# Altium schematic sheet LTC_Sheet.SchDoc
size A3
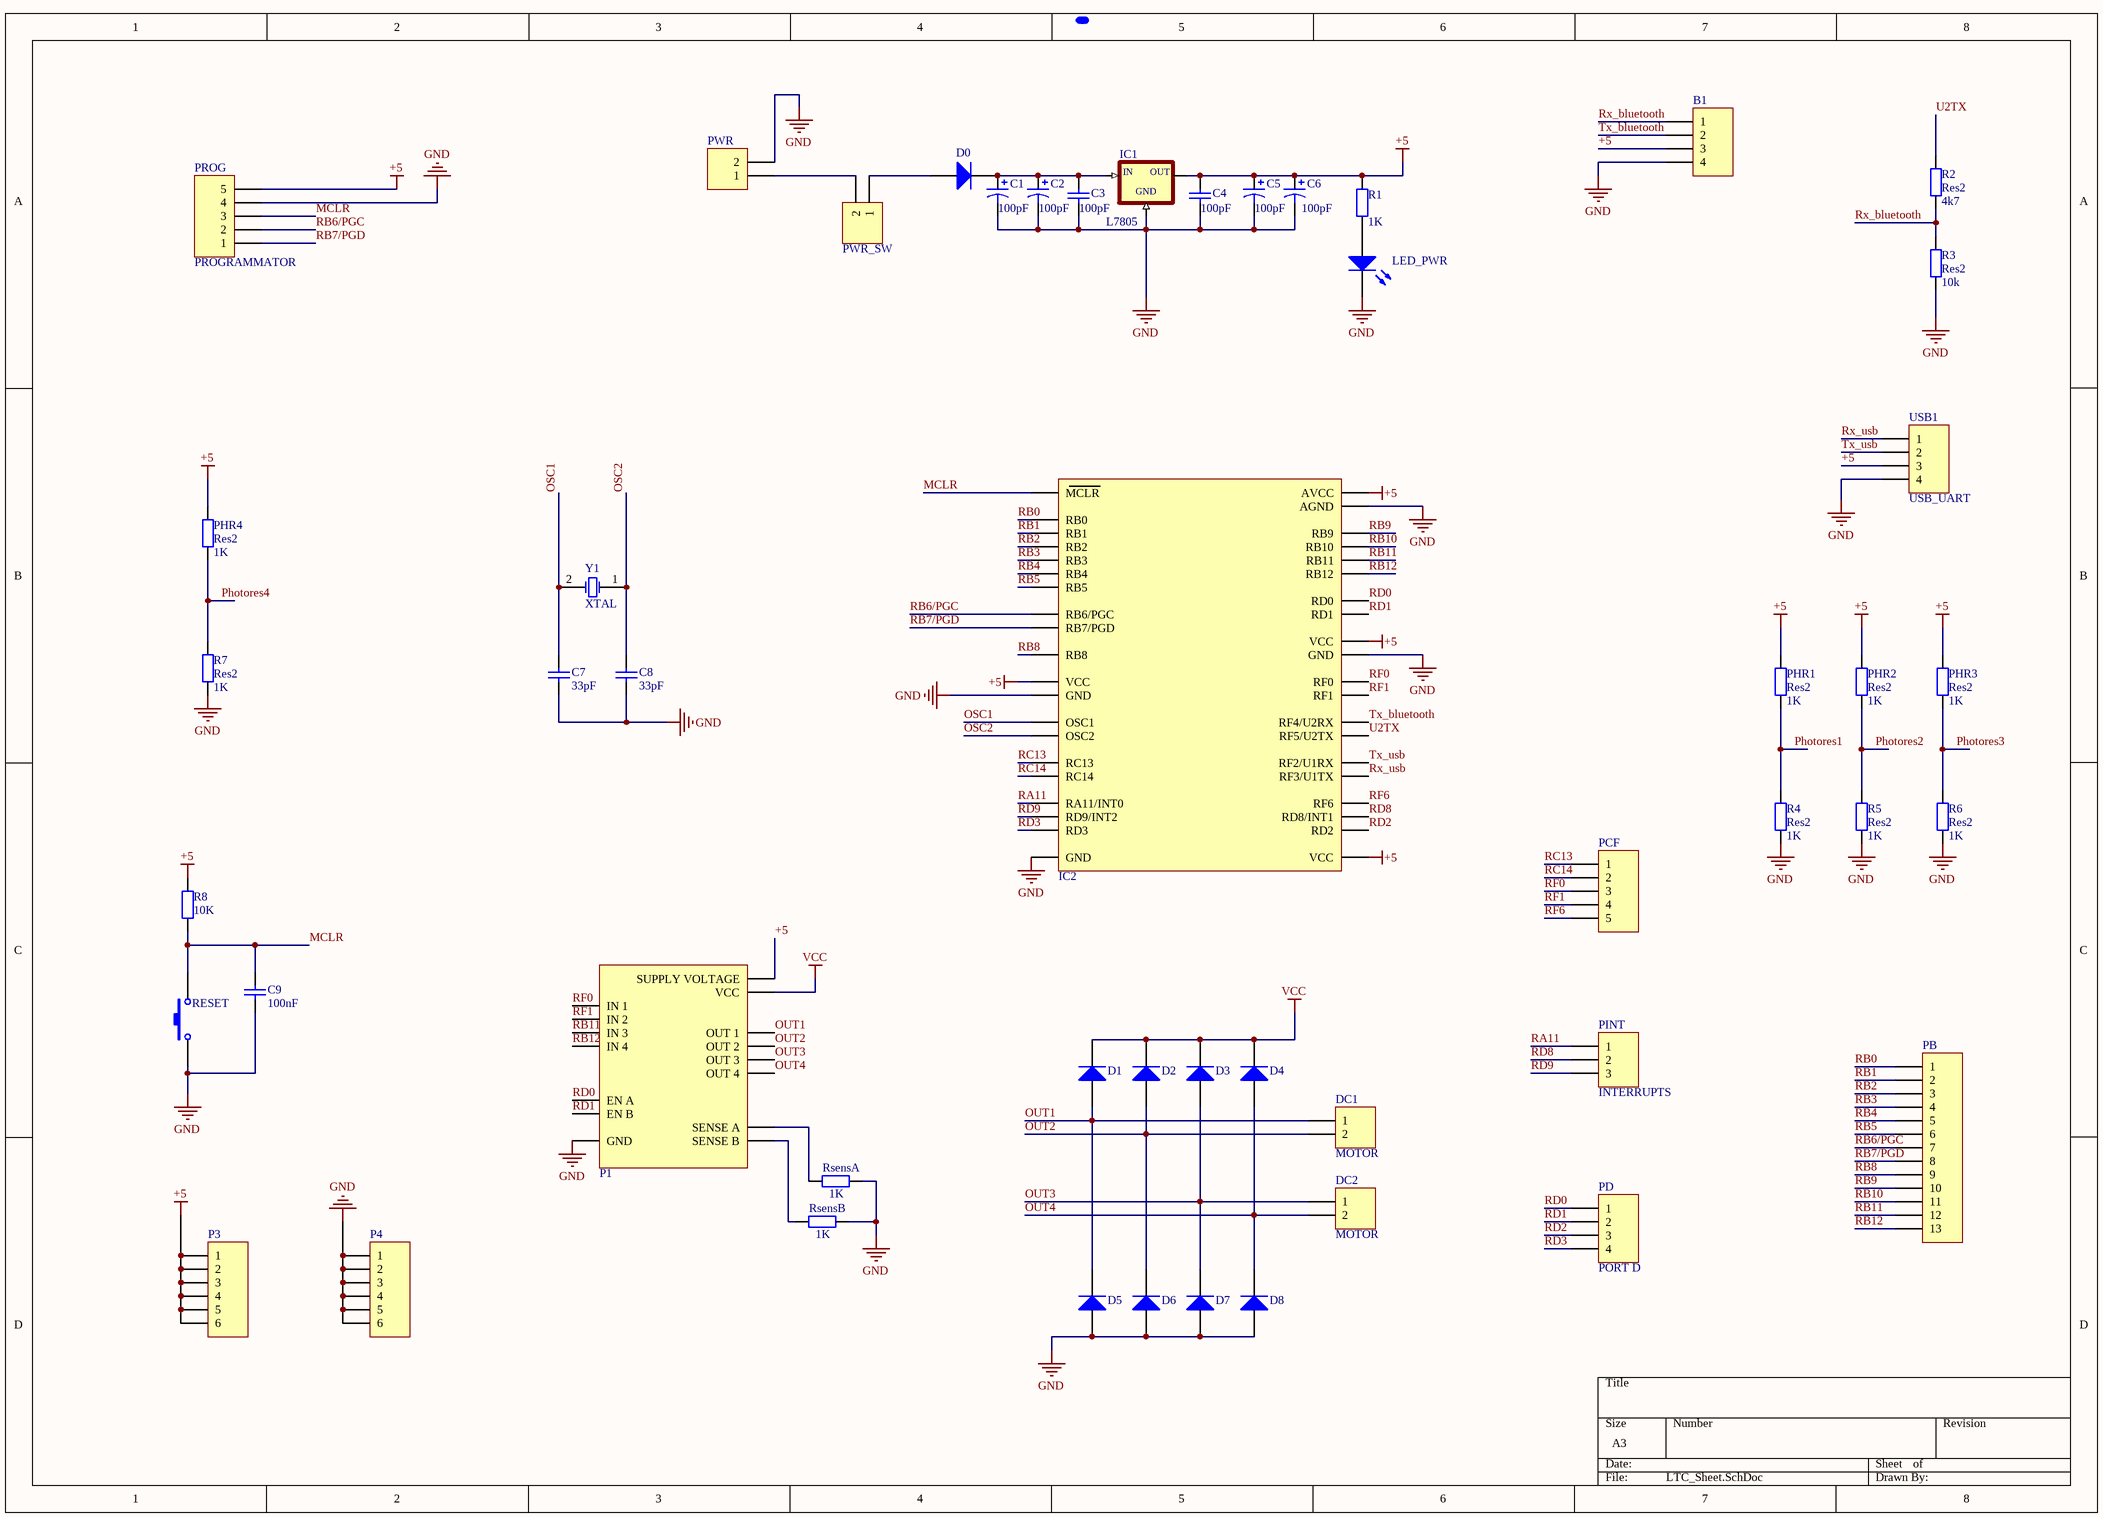
[diagram p0: LTC_Sheet.SchDoc]

## Parts
B1  (no value)  [HDR1X4]
C1  value 100pF  [RB7.6-15]
C2  value 100pF  [RB7.6-15]
C3  value 100pF  [RAD-0.3]
C4  value 100pF  [RAD-0.3]
C5  value 100pF  [RB7.6-15]
C6  value 100pF  [RB7.6-15]
C7  value 33pF  [RAD-0.3]  (hidden comment: Cap)
C8  value 33pF  [RAD-0.3]  (hidden comment: Cap)
C9  value 100nF  [RAD-0.3]  (hidden comment: Cap)
D0  (no value)  [DO-41]
D1  Diode 1N914  [DO-35]  (value not drawn)
D2  Diode 1N914  [DO-35]  (value not drawn)
D3  Diode 1N914  [DO-35]  (value not drawn)
D4  Diode 1N914  [DO-35]  (value not drawn)
D5  Diode 1N914  [DO-35]  (value not drawn)
D6  Diode 1N914  [DO-35]  (value not drawn)
D7  Diode 1N914  [DO-35]  (value not drawn)
D8  Diode 1N914  [DO-35]  (value not drawn)
DC1  MOTOR  [HDR1X2]
DC2  MOTOR  [HDR1X2]
IC1  L7805  [78XXS]
IC2  dsPIC30F4013  (value not drawn)
LED_PWR  (no value)  [LED-1]
P1  L298N  (value not drawn)
P3  (no value)  [HDR1X6]
P4  (no value)  [HDR1X6]
PB  (no value)  [HDR1X13]
PCF  (no value)  [HDR1X5]
PD  PORT D  [HDR1X4]
PHR1  Res2  value 1K  [AXIAL-0.4]
PHR2  Res2  value 1K  [AXIAL-0.4]
PHR3  Res2  value 1K  [AXIAL-0.4]
PHR4  Res2  value 1K  [AXIAL-0.4]
PINT  INTERRUPTS  [HDR1X3]
PROG  PROGRAMMATOR  [HDR1X5]
PWR  Header 2  [HDR1X2]  (value not drawn)
PWR_SW  Header 2  [HDR1X2]  (value not drawn)
R1  value 1K  [AXIAL-0.4]
R2  Res2  value 4k7  [AXIAL-0.4]
R3  Res2  value 10k  [AXIAL-0.4]
R4  Res2  value 1K  [AXIAL-0.4]
R5  Res2  value 1K  [AXIAL-0.4]
R6  Res2  value 1K  [AXIAL-0.4]
R7  Res2  value 1K  [AXIAL-0.4]
R8  value 10K  [AXIAL-0.4]  (hidden comment: Res2)
RESET  SW-PB  [SPST-2]  (value not drawn)
RsensA  value 1K  [AXIAL-0.4]
RsensB  value 1K  [AXIAL-0.4]
USB1  USB_UART  [HDR1X4]
Y1  XTAL  [R38]

## Nets
+5: B1.3 C4.2 C5.1 C6.1 IC1.OUT IC2.11(VCC) IC2.21(VCC) IC2.32(VCC) IC2.40(AVCC) P1.4(SUPPLY_VOLTAGE) P3.1 P3.2 P3.3 P3.4 P3.5 P3.6 PHR1.2 PHR2.2 PHR3.2 PHR4.2 PROG.5 R1.2 R8.2 USB1.3
GND: B1.4 C1.2 C2.2 C3.1 C4.1 C5.2 C6.2 C7.1 C8.1 C9.2 D5.1(A) D6.1(A) D7.1(A) D8.1(A) IC1.GND IC2.12(GND) IC2.20(GND) IC2.31(GND) IC2.39(AGND) LED_PWR.2(K) P1.8(GND) P4.1 P4.2 P4.3 P4.4 P4.5 P4.6 PROG.4 PWR.2 R3.1 R4.1 R5.1 R6.1 R7.1 RESET.1 RsensA.2 RsensB.2 USB1.4
VCC: D1.2(K) D2.2(K) D3.2(K) D4.2(K) P1.9(VCC)
MCLR: C9.1 IC2.1(MCLR) PROG.3 R8.1 RESET.2
OSC1: C7.2 IC2.13(OSC1) Y1.2(OSC2)
OSC2: C8.2 IC2.14(OSC2) Y1.1(OSC1)
OUT1: D1.1(A) D5.2(K) DC1.1 P1.2(OUT_1)
OUT2: D2.1(A) D6.2(K) DC1.2 P1.3(OUT_2)
OUT3: D3.1(A) D7.2(K) DC2.1 P1.13(OUT_3)
OUT4: D4.1(A) D8.2(K) DC2.2 P1.14(OUT_4)
Photores1: PHR1.1 R4.2
Photores2: PHR2.1 R5.2
Photores3: PHR3.1 R6.2
Photores4: PHR4.1 R7.2
RA11: IC2.17(RA11/INT0) PINT.1
RB0: IC2.2(RB0) PB.1
RB1: IC2.3(RB1) PB.2
RB2: IC2.4(RB2) PB.3
RB3: IC2.5(RB3) PB.4
RB4: IC2.6(RB4) PB.5
RB5: IC2.7(RB5) PB.6
RB6/PGC: IC2.8(RB6/PGC) PB.7 PROG.2
RB7/PGD: IC2.9(RB7/PGD) PB.8 PROG.1
RB8: IC2.10(RB8) PB.9
RB9: IC2.38(RB9) PB.10
RB10: IC2.37(RB10) PB.11
RB11: IC2.36(RB11) P1.10(IN_3) PB.12
RB12: IC2.35(RB12) P1.12(IN_4) PB.13
RC13: IC2.15(RC13) PCF.1
RC14: IC2.16(RC14) PCF.2
RD0: IC2.34(RD0) P1.6(EN_A) PD.1
RD1: IC2.33(RD1) P1.11(EN_B) PD.2
RD2: IC2.22(RD2) PD.3
RD3: IC2.19(RD3) PD.4
RD8: IC2.23(RD8/INT1) PINT.2
RD9: IC2.18(RD9/INT2) PINT.3
RF0: IC2.30(RF0) P1.5(IN_1) PCF.3
RF1: IC2.29(RF1) P1.7(IN_2) PCF.4
RF6: IC2.24(RF6) PCF.5
Rx_bluetooth: B1.1 R2.1 R3.2
Rx_usb: IC2.25(RF3/U1TX) USB1.1
Tx_bluetooth: B1.2 IC2.28(RF4/U2RX)
Tx_usb: IC2.26(RF2/U1RX) USB1.2
U2TX: IC2.27(RF5/U2TX) R2.2
NetC1_1: C1.1 C2.1 C3.2 D0.2(K) IC1.IN
NetD0_1: D0.1(A) PWR_SW.1
NetLED_PWR_1: LED_PWR.1(A) R1.1
NetP1_1: P1.1(SENSE_A) RsensA.1
NetP1_15: P1.15(SENSE_B) RsensB.1
NetPWR_1: PWR.1 PWR_SW.2

## Library data of the parts
B1 PD USB1 = Header 4: Header, 4-Pin; LatestRevisionDate: 17-Jul-2002; LatestRevisionNote: Re-released for DXP Platform.; Publisher: Altium Limited
C1 C2 C5 C6 = Cap Pol1: Polarized Capacitor (Radial); Published: 8-Jun-2000; LatestRevisionDate: 17-Jul-2002; LatestRevisionNote: Re-released for DXP Platform.; PackageReference: RB7.6-15; Publisher: Altium Limited; PackageDescription: Polarized Capacitor (Radial); 2 Leads
C3 C4 C7-C9 = Cap: Capacitor; Published: 8-Jun-2000; LatestRevisionDate: 17-Jul-2002; LatestRevisionNote: Re-released for DXP Platform.; PackageReference: RAD-0.3; Publisher: Altium Limited; PackageDescription: Radial Cap, Thru-Hole; 2 Leads; 0.3 in Pin Spacing
D0 = Diode 1N4007: 1 Amp General Purpose Rectifier; Published: 8-Jun-2000; LatestRevisionDate: 17-Jul-2002; LatestRevisionNote: Re-released for DXP Platform.; DatasheetVersion: 1998; PackageReference: DO-41; Publisher: Altium Limited; PackageDescription: Diode, Axial; Body 5.2 x 2.7 mm (LxDia. max), Lead Dia. 0.86 mm (max); Code_JEDEC: DO-204-AL; ComponentLink1Description: Manufacturer Link; ComponentLink1URL: http://www.fairchildsemi.com/; ComponentLink2Description: Datasheet; ComponentLink2URL: http://www.fairchildsemi.com/ds/1N%2F1N4001.pdf; PackageVersion: Aug-1999
D1-D8 = Diode 1N914: High Conductance Fast Diode; Published: 8-Jun-2000; LatestRevisionDate: 17-Jul-2002; LatestRevisionNote: Re-released for DXP Platform.; DatasheetVersion: 1997; PackageReference: DO-35; Publisher: Altium Limited; PackageDescription: Diode, Axial; Body 3.8 x 1.9 mm (LxDia. max), Lead Dia. 0.53 mm (max); Code_JEDEC: DO-204-AH; ComponentLink1Description: Manufacturer Link; ComponentLink1URL: http://www.fairchildsemi.com/; ComponentLink2Description: Datasheet; ComponentLink2URL: http://www.fairchildsemi.com/ds/1N%2F1N4448.pdf
DC1 DC2 PWR PWR_SW = Header 2: Header, 2-Pin; LatestRevisionDate: 17-Jul-2002; LatestRevisionNote: Re-released for DXP Platform.; Publisher: Altium Limited
IC1 = L7805: Linear Voltage Regulator IC 1 Output 1.5A D2PAK; MF: STMicroelectronics; Package: TO-263-3 Inchange Semiconductor; Availability: Unavailable; MP: L7805; Value: *; SnapEDA_Link: https://www.snapeda.com/parts/L7805/STMicroelectronics/view-part/563125/?ref=snap; Price: None
IC2 = IC_40
LED_PWR = LED1: Typical RED GaAs LED; Published: 8-Jun-2000; LatestRevisionDate: 08-Jul-2005; LatestRevisionNote: Mech Layer 1 removed.; PackageReference: LED-1; Publisher: Altium Limited; PackageDescription: LED; 2 Leads
P3 P4 = Header 6: Header, 6-Pin; LatestRevisionDate: 17-Jul-2002; LatestRevisionNote: Re-released for DXP Platform.; Publisher: Altium Limited
PB = Header 13: Header, 13-Pin; LatestRevisionDate: 17-Jul-2002; LatestRevisionNote: Re-released for DXP Platform.; Publisher: Altium Limited
PCF PROG = Header 5: Header, 5-Pin; LatestRevisionDate: 17-Jul-2002; LatestRevisionNote: Re-released for DXP Platform.; Publisher: Altium Limited
PHR1-PHR4 R1-R8 RsensA RsensB = Res2: Resistor; Published: 8-Jun-2000; LatestRevisionDate: 17-Jul-2002; LatestRevisionNote: Re-released for DXP Platform.; PackageReference: AXIAL-0.4; Publisher: Altium Limited; PackageDescription: Axial Device, Thru-Hole; 2 Leads; 0.4 in Pin Spacing
PINT = Header 3: Header, 3-Pin; LatestRevisionDate: 17-Jul-2002; LatestRevisionNote: Re-released for DXP Platform.; Publisher: Altium Limited
RESET = SW-PB: Switch; Published: 24-Mar-1999; LatestRevisionDate: 17-Jul-2002; LatestRevisionNote: Re-released for DXP Platform.; PackageReference: SPST-2; Publisher: Altium Limited; PackageDescription: Switch; 2 Leads
Y1 = XTAL: Crystal Oscillator; Published: 8-Jun-2000; LatestRevisionDate: 17-Jul-2002; LatestRevisionNote: Re-released for DXP Platform.; PackageReference: R38; Publisher: Altium Limited; PackageDescription: Crystal, Thru-Hole; 2 Leads; Body 3.1 x 8.2 mm (Dia.xH)